# Altium schematic sheet Main&Motor&Connector.SchDoc
size A4
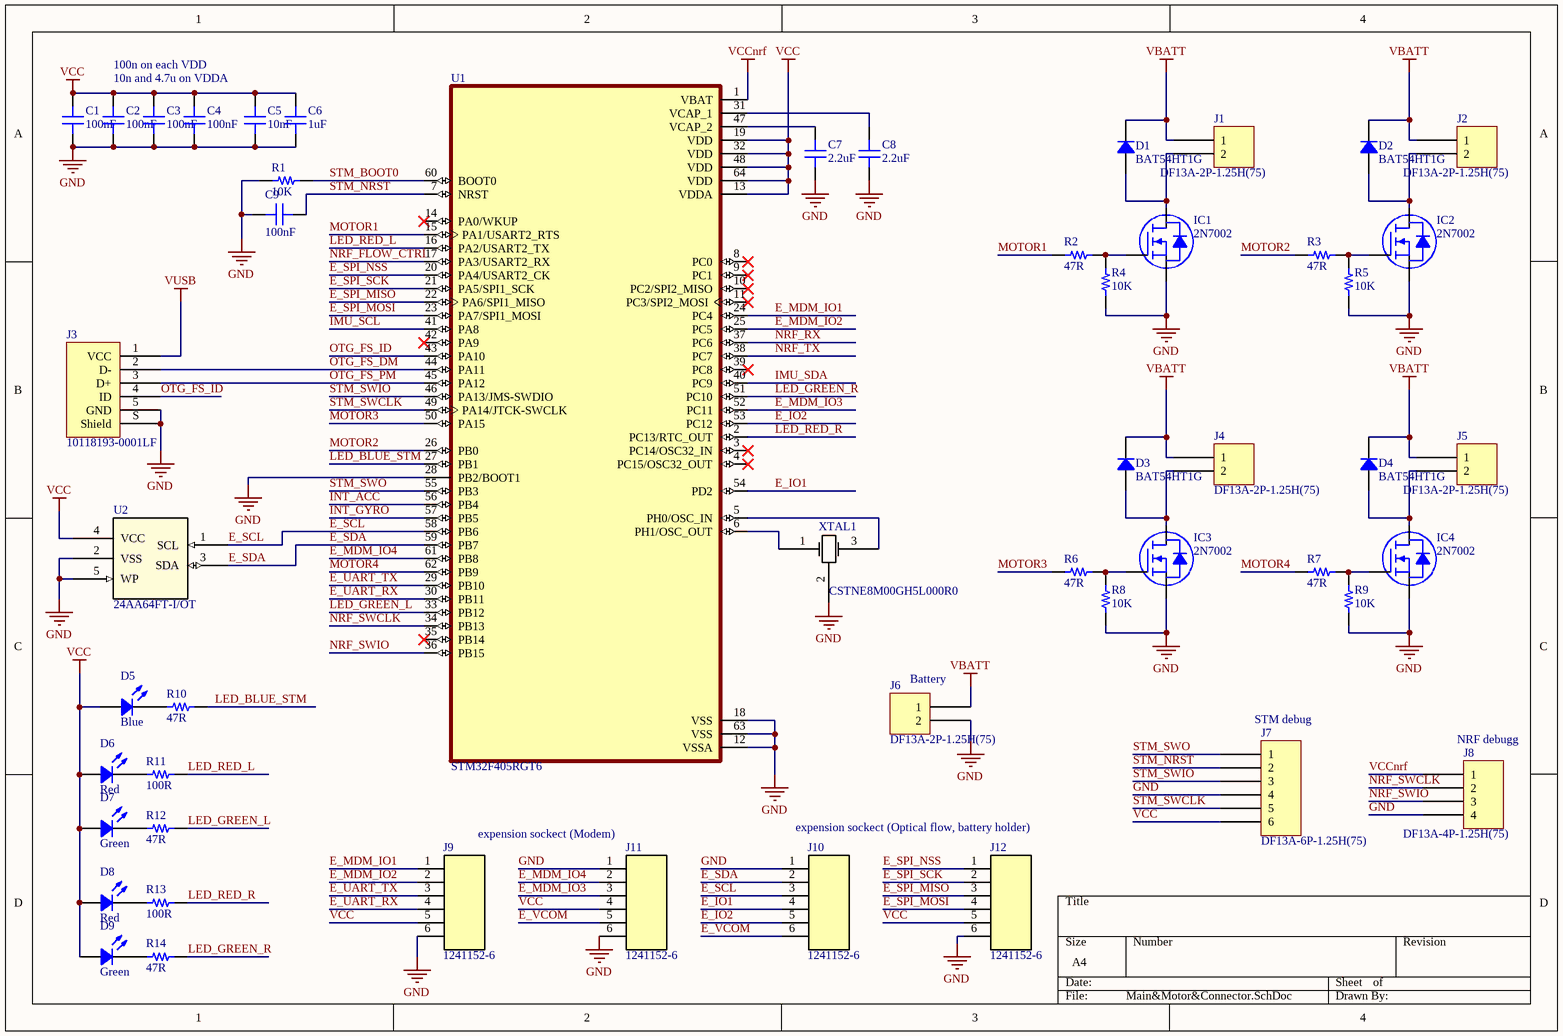
[diagram p0: Main&Motor&Connector.SchDoc]

## Parts
C1  100nF  [CAP 0402_1005]
C2  100nF  [CAP 0402_1005]
C3  100nF  [CAP 0402_1005]
C4  100nF  [CAP 0402_1005]
C5  10nF  [CAP 0402_1005]
C6  1uF  [CAP 0402_1005]
C7  2.2uF  [CAP 0603_1608]
C8  2.2uF  [CAP 0603_1608]
C9  100nF  [CAP 0402_1005]
D1  BAT54HT1G  [SOD323]
D2  BAT54HT1G  [SOD323]
D3  BAT54HT1G  [SOD323]
D4  BAT54HT1G  [SOD323]
D5  Blue  [LED 0603_1608 BLUE]
D6  Red  [LED 0603_1608 RED]
D7  Green  [LED 0603_1608 GREEN]
D8  Red  [LED 0603_1608 RED]
D9  Green  [LED 0603_1608 GREEN]
IC1  2N7002  [ON SEMI SOT-23-3]
IC2  2N7002  [ON SEMI SOT-23-3]
IC3  2N7002  [ON SEMI SOT-23-3]
IC4  2N7002  [ON SEMI SOT-23-3]
J1  DF13A-2P-1.25H(75)  [HIROSE DF13A-2P-1.25H]
J2  DF13A-2P-1.25H(75)  [HIROSE DF13A-2P-1.25H]
J3  10118193-0001LF  [FCI USB 10118193-0001LF]
J4  DF13A-2P-1.25H(75)  [HIROSE DF13A-2P-1.25H]
J5  DF13A-2P-1.25H(75)  [HIROSE DF13A-2P-1.25H]
J6  DF13A-2P-1.25H(75)  [HIROSE DF13A-2P-1.25H]
J7  DF13A-6P-1.25H(75)  [HIROSE DF13A-6P-1.25H]
J8  DF13A-4P-1.25H(75)  [HIROSE DF13A-4P-1.25H]
J9  1241152-6  [CONN_1241152-6_T]
J10  1241152-6  [CONN_1241152-6_T]
J11  1241152-6  [CONN_1241152-6_T]
J12  1241152-6  [CONN_1241152-6_T]
R1  10K  [RES 0402_1005]
R2  47R  [RES 0603_1608]
R3  47R  [RES 0603_1608]
R4  10K  [RES 0603_1608]
R5  10K  [RES 0603_1608]
R6  47R  [RES 0603_1608]
R7  47R  [RES 0603_1608]
R8  10K  [RES 0603_1608]
R9  10K  [RES 0603_1608]
R10  47R  [RES 0603_1608]
R11  100R  [RES 0603_1608]
R12  47R  [RES 0603_1608]
R13  100R  [RES 0603_1608]
R14  47R  [RES 0603_1608]
U1  STM32F405RGT6  [QFP50P1200X1200X160-64N]
U2  24AA64FT-I/OT  [SOT-23-5_MC_MCH]
XTAL1  CSTNE8M00GH5L000R0  [CSTNE8M00GH5L000]

## Nets
GND: C1.1 C2.1 C3.1 C4.1 C5.1 C6.1 C7.2 C8.1 C9.2 IC1.2(S) IC2.2(S) IC3.2(S) IC4.2(S) J3.5(GND) J3.S(Shield) J6.2 J7.4 J8.4 J9.6 J10.1 J11.1 J11.6 J12.6 R1.1 R4.1 R5.1 R8.1 R9.1 U1.12(VSSA) U1.18(VSS) U1.28(PB2/BOOT1) U1.63(VSS) U2.2(VSS) U2.5(WP) XTAL1.2(GND)
VBATT: D1.2 D2.2 D3.2 D4.2 J1.1 J2.1 J4.1 J5.1 J6.1
VCC: C1.2 C2.2 C3.2 C4.2 C5.2 C6.2 D5.1 D6.1 D7.1 D8.1 D9.1 J7.6 J9.5 J11.4 J12.5 U1.13(VDDA) U1.19(VDD) U1.32(VDD) U1.48(VDD) U1.64(VDD) U2.4(VCC)
VCCnrf: J8.1 U1.1(VBAT)
VUSB: J3.1(VCC)
E_IO1: J10.4 U1.54(PD2)
E_IO2: J10.5 U1.53(PC12)
E_MDM_IO1: J9.1 U1.24(PC4)
E_MDM_IO2: J9.2 U1.25(PC5)
E_MDM_IO3: J11.3 U1.52(PC11)
E_MDM_IO4: J11.2 U1.61(PB8)
E_SCL: J10.3 U1.58(PB6) U2.1(SCL)
E_SDA: J10.2 U1.59(PB7) U2.3(SDA)
E_SPI_MISO: J12.3 U1.22(PA6/SPI1_MISO)
E_SPI_MOSI: J12.4 U1.23(PA7/SPI1_MOSI)
E_SPI_NSS: J12.1 U1.20(PA4/USART2_CK)
E_SPI_SCK: J12.2 U1.21(PA5/SPI1_SCK)
E_UART_RX: J9.4 U1.30(PB11)
E_UART_TX: J9.3 U1.29(PB10)
E_VCOM: J10.6 J11.5
IMU_SCL: U1.41(PA8)
IMU_SDA: U1.40(PC9)
INT_ACC: U1.56(PB4)
INT_GYRO: U1.57(PB5)
LED_BLUE_STM: R10.1 U1.27(PB1)
LED_GREEN_L: R12.1 U1.33(PB12)
LED_GREEN_R: R14.1 U1.51(PC10)
LED_RED_L: R11.1 U1.16(PA2/USART2_TX)
LED_RED_R: R13.1 U1.2(PC13/RTC_OUT)
MOTOR1: R2.1 U1.15(PA1/USART2_RTS)
MOTOR2: R3.1 U1.26(PB0)
MOTOR3: R6.1 U1.50(PA15)
MOTOR4: R7.1 U1.62(PB9)
NRF_FLOW_CTRL: U1.17(PA3/USART2_RX)
NRF_RX: U1.37(PC6)
NRF_SWCLK: J8.2 U1.34(PB13)
NRF_SWIO: J8.3 U1.36(PB15)
NRF_TX: U1.38(PC7)
OTG_FS_DM: J3.2(D-) U1.44(PA11)
OTG_FS_ID: J3.4(ID) U1.43(PA10)
OTG_FS_PM: J3.3(D+) U1.45(PA12)
STM_BOOT0: R1.2 U1.60(BOOT0)
STM_NRST: C9.1 J7.2 U1.7(NRST)
STM_SWCLK: J7.5 U1.49(PA14/JTCK-SWCLK)
STM_SWIO: J7.3 U1.46(PA13/JMS-SWDIO)
STM_SWO: J7.1 U1.55(PB3)
NetC7_1: C7.1 U1.47(VCAP_2)
NetC8_2: C8.2 U1.31(VCAP_1)
NetD1_1: D1.1 IC1.3(D) J1.2
NetD2_1: D2.1 IC2.3(D) J2.2
NetD3_1: D3.1 IC3.3(D) J4.2
NetD4_1: D4.1 IC4.3(D) J5.2
NetD5_2: D5.2 R10.2
NetD6_2: D6.2 R11.2
NetD7_2: D7.2 R12.2
NetD8_2: D8.2 R13.2
NetD9_2: D9.2 R14.2
NetIC1_1: IC1.1(G) R2.2 R4.2
NetIC2_1: IC2.1(G) R3.2 R5.2
NetIC3_1: IC3.1(G) R6.2 R8.2
NetIC4_1: IC4.1(G) R7.2 R9.2
NetU1_5: U1.5(PH0/OSC_IN) XTAL1.3(OUTPUT)
NetU1_6: U1.6(PH1/OSC_OUT) XTAL1.1(INPUT)

Not connected (* = marked no-connect by the designer): U1 3(PC14/OSC32_IN)* 4(PC15/OSC32_OUT)* 8(PC0)* 9(PC1)* 10(PC2/SPI2_MISO)* 11(PC3/SPI2_MOSI)* 14(PA0/WKUP)* 35(PB14)* 39(PC8)* 42(PA9)*

## Notes on the sheet
- 100n on each VDD
- 10n and 4.7u on VDDA
- (near J6) Battery
- (near J7) STM debug
- (near J8) NRF debugg
- expension sockect (Modem)
- expension sockect (Optical flow, battery holder)

## Library data of the parts
C1-C6 C9 = C0402C104M4VACTU: CAP CER 0.1UF 16V Y5V 0402; Manufacturer: KEMET; Capacitance: 0.1µF; Temperature Coefficient: Y5V (F); Tolerance: ±20%; Part Number: C0402C104M4VACTU; Applications: General Purpose; ComponentLink1Description: Datasheet; ComponentLink1URL: //media.digikey.com/PDF/Data%20Sheets/Kemet%20PDFs/COG%20Dielectric.pdf; ComponentLink2Description: DigiKey Link; ComponentLink2URL: http://digikey.com/product-detail/en/kemet/C0402C104M4VACTU/399-7332-1-ND/3316949; Device Package: 0402 (1005 Metric); LastUpdated: 4/1/2020 11:57:05 PM; Lifecycle Status: Active; Minimum Order: 1; Mounting Type: Surface Mount, MLCC; Operating Temperature: -30°C ~ 85°C; Package / Case: 0402 (1005 Metric); Packaging: TapeAndReel; PartId: 1738; Part Status: Active; Price: 0.08; Series: SMD Comm Y5V; Size / Dimension: 0.039" L x 0.020" W (1.00mm x 0.50mm); Supplier 1: DigiKey; Supplier Part Number 1: 399-7332-1-ND; Thickness (Max): 0.022" (0.55mm); Voltage - Rated: 16V
  C1-C4 C9: Value: 100nF
  C5: Value: 10nF
  C6: Value: 1uF
C7 C8 = C0603X101F5GAC7867: CAP CER 100PF 50V C0G/NP0 0603; Manufacturer: KEMET; Temperature Coefficient: C0G, NP0; Tolerance: ±1%; Part Number: C0603X101F5GAC7867; Value: 2.2uF; Applications: Boardflex Sensitive; Capacitance: 100pF; ComponentLink1Description: Datasheet; ComponentLink1URL: https://api.kemet.com/component-edge/download/datasheet/C0603X101F5GAC7867.pdf; ComponentLink2Description: DigiKey Link; ComponentLink2URL: http://digikey.com/product-detail/en/kemet/C0603X101F5GAC7867/399-20433-1-ND/9925037; Device Package: 0603 (1608 Metric); Features: Low ESL, Soft Termination; LastUpdated: 1/21/2020 12:02:09 AM; Lifecycle Status: Active; Minimum Order: 1; Mounting Type: Surface Mount, MLCC; Operating Temperature: -55°C ~ 125°C; Package / Case: 0603 (1608 Metric); Packaging: TapeAndReel; PartId: 2140; Part Status: Active; Price: 0.46; Series: SMD Comm C0G Flex; Size / Dimension: 0.063" L x 0.031" W (1.60mm x 0.80mm); Supplier 1: DigiKey; Supplier Part Number 1: 399-20433-1-ND; Thickness (Max): 0.037" (0.95mm); Voltage - Rated: 50V
D1-D4 = BAT54HT1G: DIODE SCHOTTKY 30V 200MA SOD323; Manufacturer: ON Semiconductor; Capacitance @ Vr, F: 10pF @ 1V, 1MHz; Current - Average Rectified (Io): 200mA (DC); Current - Reverse Leakage @ Vr: 2µA @ 25V; Reverse Recovery Time (trr): 5ns; Speed: Small Signal =< 200mA (Io), Any Speed; Voltage - Forward (Vf) (Max) @ If: 800mV @ 100mA; Part Number: BAT54HT1G; ComponentLink1Description: Datasheet; ComponentLink1URL: //media.digikey.com/pdf/Data%20Sheets/Fairchild%20PDFs/BAT54HT1G_Rev_1.2.pdf; ComponentLink2Description: DigiKey Link; ComponentLink2URL: http://digikey.com/product-detail/en/on-semiconductor/BAT54HT1G/BAT54HT1GOSCT-ND/917809; Device Package: SC-76, SOD-323; Diode Type: Schottky; LastUpdated: 2/4/2020 3:13:59 PM; Lifecycle Status: Active; Minimum Order: 1; Mounting Type: Surface Mount; Operating Temperature - Junction: -55°C ~ 150°C; Package / Case: SC-76, SOD-323; Packaging: TapeAndReel; PartId: 3080; Part Status: Active; Price: 0.04; Series: -; Supplier 1: DigiKey; Supplier Part Number 1: BAT54HT1GOSCT-ND; Supplier Device Package: SOD-323; Voltage - DC Reverse (Vr) (Max): 30V
D5 = XZFBB53W-1: LED BLUE CLEAR 2SMD; Manufacturer: SunLED; Configuration: Standard; Current - Test: 20mA; Lens Color: Colorless; Lens Size: 1.20mm x 0.80mm; Lens Style: Rectangle with Flat Top; Millicandela Rating: 178mcd; Viewing Angle: 130°; Voltage - Forward (Vf) (Typ): 3.3V; Wavelength - Dominant: 470nm; Wavelength - Peak: 465nm; Part Number: XZFBB53W-1; Color: Blue; ComponentLink1Description: Datasheet; ComponentLink1URL: https://www.sunledusa.com/products/spec/XZFBB53W-1.pdf; ComponentLink2Description: DigiKey Link; ComponentLink2URL: http://digikey.com/product-detail/en/sunled/XZFBB53W-1/1497-1310-1-ND/6615742; Device Package: 0603 (1608 Metric); Height (Max): 0.85mm; LastUpdated: 1/21/2020 3:11:01 AM; Lens Transparency: Clear; Lifecycle Status: Active; Minimum Order: 1; Mounting Type: Surface Mount; Package / Case: 0603 (1608 Metric); Packaging: TapeAndReel; PartId: 782; Part Status: Active; Price: 0.15; Series: -; Size / Dimension: 1.60mm L x 0.80mm W; Supplier 1: DigiKey; Supplier Part Number 1: 1497-1310-1-ND; Supplier Device Package: 2-SMD; Value: Blue
D6 D8 = 5973005507F: LED RED 0603 SMD; Manufacturer: Dialight; Configuration: Standard; Current - Test: 20mA; Lens Color: 0.68mm; Lens Size: 1.20mm x 0.80mm; Lens Style: Rectangle with Flat Top; Millicandela Rating: 90mcd; Voltage - Forward (Vf) (Typ): 2V; Wavelength - Dominant: 630nm; Part Number: 5973005507F; Color: Red; ComponentLink1Description: Datasheet; ComponentLink1URL: http://www.dialightsignalsandcomponents.com/Assets/Drawings/2D_Drawings_DrawingDetailedSpec/NewDrawings/18369A.pdf; ComponentLink2Description: DigiKey Link; ComponentLink2URL: http://digikey.com/product-detail/en/dialight/5973005507F/350-4374-1-ND/9385480; Device Package: 0603 (1608 Metric); Height (Max): 0.68mm; LastUpdated: 1/21/2020 3:13:27 AM; Lifecycle Status: Active; Minimum Order: 1; Mounting Type: Surface Mount; Package / Case: 0603 (1608 Metric); Packaging: TapeAndReel; PartId: 378; Part Status: Active; Price: 0.11; Series: 597; Size / Dimension: 1.60mm L x 0.80mm W; Supplier 1: DigiKey; Supplier Part Number 1: 350-4374-1-ND; Supplier Device Package: 0603; Value: Red
D7 D9 = XZVG53W-3: LED GREEN CLEAR CHIP SMD; Manufacturer: SunLED; Configuration: Standard; Current - Test: 20mA; Lens Color: Colorless; Lens Size: 1.10mm x 0.80mm; Lens Style: Rectangle with Flat Top; Millicandela Rating: 49mcd; Viewing Angle: 120°; Voltage - Forward (Vf) (Typ): 2.1V; Wavelength - Dominant: 570nm; Wavelength - Peak: 574nm; Part Number: XZVG53W-3; Color: Green; ComponentLink1Description: Datasheet; ComponentLink1URL: https://www.sunledusa.com/products/spec/XZVG53W-3.pdf; ComponentLink2Description: DigiKey Link; ComponentLink2URL: http://digikey.com/product-detail/en/sunled/XZVG53W-3/1497-1214-1-ND/4745906; Device Package: 0603 (1608 Metric); Height (Max): 0.45mm; LastUpdated: 1/21/2020 3:12:15 AM; Lens Transparency: Clear; Lifecycle Status: Active; Minimum Order: 1; Mounting Type: Surface Mount; Package / Case: 0603 (1608 Metric); Packaging: TapeAndReel; PartId: 580; Part Status: Active; Price: 0.07; Series: -; Size / Dimension: 1.60mm L x 0.80mm W; Supplier 1: DigiKey; Supplier Part Number 1: 1497-1214-1-ND; Supplier Device Package: Chip LED; Value: Green
IC1-IC4 = 2N7002: MOSFET N-CH 60V 115MA SOT-23; Manufacturer: ON Semiconductor; Current - Continuous Drain (Id) @ 25°C: 115mA (Ta); Drive Voltage (Max Rds On,  Min Rds On): 5V, 10V; FET Type: N-Channel; Input Capacitance (Ciss) (Max) @ Vds: 50pF @ 25V; Power Dissipation (Max): 200mW (Ta); Rds On (Max) @ Id, Vgs: 7.5Ohm @ 500mA, 10V; Vgs (Max): ±20V; Vgs(th) (Max) @ Id: 2.5V @ 250µA; Part Number: 2N7002; ComponentLink1Description: Datasheet; ComponentLink1URL: https://www.onsemi.com/pub/Collateral/NDS7002A-D.PDF; ComponentLink2Description: DigiKey Link; ComponentLink2URL: http://digikey.com/product-detail/en/on-semiconductor/2N7002/2N7002NCT-ND/244664; Device Package: TO-236-3, SC-59, SOT-23-3; Drain to Source Voltage (Vdss): 60V; LastUpdated: 1/21/2020 4:01:12 AM; Lifecycle Status: Active; Minimum Order: 1; Mounting Type: Surface Mount; Operating Temperature: -55°C ~ 150°C (TJ); Package / Case: TO-236-3, SC-59, SOT-23-3; Packaging: TapeAndReel; Part Status: Active; Price: 0.06; Series: -; Supplier 1: DigiKey; Supplier Part Number 1: 2N7002NCT-ND; Supplier Device Package: SOT-23 (TO-236AB); Technology: MOSFET (Metal Oxide)
J1 J2 J4-J6 = DF13A-2P-1.25H(75): CONN HEADER SMD R/A 2POS 1.25MM; Manufacturer: Hirose Electric Co Ltd; Current Rating (Amps): 1A; Material Flammability Rating: UL94 V-0; Number of Positions: 2; Number of Positions Loaded: All; Pitch - Mating: 0.049" (1.25mm); Shrouding: Shrouded - 4 Wall; Style: Board to Cable/Wire; Voltage Rating: 150V; Part Number: DF13A-2P-1.25H(75); ComponentLink1Description: Datasheet; ComponentLink1URL: https://www.hirose.com/product/download/?distributor=digikey&type=specSheet&lang=en&num=DF13A-2P-1.25H(75); ComponentLink2Description: DigiKey Link; ComponentLink2URL: //digikey.com/product-detail/en/hirose-electric-co-ltd/DF13A-2P-1.25H-75/H126434-ND/9170674; Connector Type: Header; Contact Finish - Mating: Tin; Contact Finish - Post: Tin; Contact Finish Thickness - Mating: 39.4µin (1.00µm); Contact Material: Brass; Contact Shape: Square; Contact Type: Male Pin; Fastening Type: Detent Lock; Features: Solder Retention; Insulation Color: Beige; Insulation Height: 0.142" (3.60mm); Insulation Material: Polyamide (PA), Nylon; LastUpdated: 12/16/2019 7:33:40 PM; Lifecycle Status: 0; Minimum Order: 1; Mounting Type: Surface Mount, Right Angle; Number of Rows: 1; Operating Temperature: -35°C ~ 85°C; Packaging: Tube; PartId: 6; Part Status: Active; Price: 0.37; Series: DF13; Supplier 1: DigiKey; Supplier Part Number 1: H126434-ND; Termination: Solder
J3 = 10118193-0001LF: CONN RCPT USB2.0 MICRO B SMD R/A; Manufacturer: Amphenol ICC (FCI); Connector Type: USB - micro B; Current Rating (Amps): 1.8A per Contact; Gender: Receptacle; Mating Cycles: 10000; Number of Contacts: 5; Number of Ports: 1; Shielding: Shielded; Voltage - Rated: 100VAC; Part Number: 10118193-0001LF; ComponentLink1Description: Datasheet; ComponentLink1URL: https://cdn.amphenol-icc.com/media/wysiwyg/files/documentation/datasheet/inputoutput/io_usb_micro.pdf; ComponentLink2Description: DigiKey Link; ComponentLink2URL: //digikey.com/product-detail/en/amphenol-icc-fci/10118193-0001LF/609-4616-2-ND/2785388; Features: Solder Retention; LastUpdated: 12/9/2019 8:51:28 PM; Lifecycle Status: 0; Minimum Order: 1; Mounting Feature: Horizontal; Mounting Type: Surface Mount, Right Angle; Through Hole; Operating Temperature: -30°C ~ 80°C; Packaging: TapeAndReel; Part Status: Active; Price: 0.21; Series: -; Specifications: USB 2.0; Supplier 1: DigiKey; Supplier Part Number 1: 609-4616-2-ND; Termination: Solder
J7 = DF13A-6P-1.25H(75): CONN HEADER SMD R/A 6POS 1.25MM; Manufacturer: Hirose Electric Co Ltd; Current Rating (Amps): 1A; Material Flammability Rating: UL94 V-0; Number of Positions: 6; Number of Positions Loaded: All; Pitch - Mating: 0.049" (1.25mm); Shrouding: Shrouded - 4 Wall; Style: Board to Cable/Wire; Voltage Rating: 150V; Part Number: DF13A-6P-1.25H(75); ComponentLink1Description: Datasheet; ComponentLink1URL: https://www.hirose.com/product/document?clcode=CL0536-0109-0-76&productname=DF13-10P-1.25DSA(76)&series=DF13&documenttype=Catalog&lang=en&documentid=D31687_en; ComponentLink2Description: DigiKey Link; ComponentLink2URL: http://digikey.com/product-detail/en/hirose-electric-co-ltd/DF13A-6P-1.25H-75/H126442-ND/9170682; Connector Type: Header; Contact Finish - Mating: Tin; Contact Finish - Post: Tin; Contact Finish Thickness - Mating: 39.4µin (1.00µm); Contact Material: Brass; Contact Shape: Square; Contact Type: Male Pin; Fastening Type: Detent Lock; Features: Solder Retention; Insulation Color: Beige; Insulation Height: 0.142" (3.60mm); Insulation Material: Polyamide (PA), Nylon; LastUpdated: 1/15/2020 3:36:45 AM; Lifecycle Status: Active; Minimum Order: 1; Mounting Type: Surface Mount, Right Angle; Number of Rows: 1; Operating Temperature: -35°C ~ 85°C; Packaging: Tube; PartId: 10; Part Status: Active; Price: 0.51; Series: DF13; Supplier 1: DigiKey; Supplier Part Number 1: H126442-ND; Termination: Solder
J8 = DF13A-4P-1.25H(75): CONN HEADER SMD R/A 4POS 1.25MM; Manufacturer: Hirose Electric Co Ltd; Current Rating (Amps): 1A; Material Flammability Rating: UL94 V-0; Number of Positions: 4; Number of Positions Loaded: All; Pitch - Mating: 0.049" (1.25mm); Shrouding: Shrouded - 4 Wall; Style: Board to Cable/Wire; Voltage Rating: 150V; Part Number: DF13A-4P-1.25H(75); ComponentLink1Description: Datasheet; ComponentLink1URL: https://www.hirose.com/product/download/?distributor=digikey&type=specSheet&lang=en&num=DF13A-4P-1.25H(75); ComponentLink2Description: DigiKey Link; ComponentLink2URL: //digikey.com/product-detail/en/hirose-electric-co-ltd/DF13A-4P-1.25H-75/H126438-ND/9170678; Connector Type: Header; Contact Finish - Mating: Tin; Contact Finish - Post: Tin; Contact Finish Thickness - Mating: 39.4µin (1.00µm); Contact Material: Brass; Contact Shape: Square; Contact Type: Male Pin; Fastening Type: Detent Lock; Features: Solder Retention; Insulation Color: Beige; Insulation Height: 0.142" (3.60mm); Insulation Material: Polyamide (PA), Nylon; LastUpdated: 12/16/2019 7:34:28 PM; Lifecycle Status: 0; Minimum Order: 1; Mounting Type: Surface Mount, Right Angle; Number of Rows: 1; Operating Temperature: -35°C ~ 85°C; Packaging: Tube; PartId: 8; Part Status: Active; Price: 0.45; Series: DF13; Supplier 1: DigiKey; Supplier Part Number 1: H126438-ND; Termination: Solder
J9-J12 = 1241152-6: con 6pos 2.54mm TE connectivity; Built_By: EMA_UL_Team; SourceLibrary: Tyco_2012-1-03; Vendor: TE Connectivity; Manufacturer_Part_Number: 1241152-6; Copyright: Copyright (C) 2016 Accelerated Designs. All rights reserved; RefDes: RefDes; Type: DEV
R1 = RT0402FRE074K7L: RES SMD 4.7K OHM 1% 1/16W 0402; Manufacturer: Yageo; Power (Watts): 0.063W, 1/16W; Resistance: 4.7 kOhms; Temperature Coefficient: ±50ppm/°C; Part Number: RT0402FRE074K7L; Value: 10K; ComponentLink1Description: Datasheet; ComponentLink1URL: https://www.yageo.com/upload/media/product/productsearch/datasheet/rchip/PYu-RT_1-to-0.01_RoHS_L_11.pdf; ComponentLink2Description: DigiKey Link; ComponentLink2URL: http://digikey.com/product-detail/en/yageo/RT0402FRE074K7L/YAG3347CT-ND/5418052; Composition: Thin Film; Device Package: 0402 (1005 Metric); Height - Seated (Max): 0.014" (0.35mm); LastUpdated: 1/21/2020 12:06:02 AM; Lifecycle Status: Active; Minimum Order: 1; Number of Terminations: 2; Operating Temperature: -55°C ~ 155°C; Package / Case: 0402 (1005 Metric); Packaging: TapeAndReel; PartId: 3198; Part Status: Active; Price: 0.01; Series: RT; Size / Dimension: 0.039" L x 0.020" W (1.00mm x 0.50mm); Supplier 1: DigiKey; Supplier Part Number 1: YAG3347CT-ND; Supplier Device Package: 0402; Tolerance: ±1%
R2-R14 = AC0603FR-0710KL: RES SMD 10K OHM 1% 1/10W 0603; Manufacturer: Yageo; Power (Watts): 0.1W, 1/10W; Resistance: 10 kOhms; Temperature Coefficient: ±100ppm/°C; Part Number: AC0603FR-0710KL; ComponentLink1Description: Datasheet; ComponentLink1URL: https://www.yageo.com/upload/media/product/productsearch/datasheet/rchip/PYu-AC_51_RoHS_L_7.pdf; ComponentLink2Description: DigiKey Link; ComponentLink2URL: http://digikey.com/product-detail/en/yageo/AC0603FR-0710KL/311-10KLDCT-ND/2828135; Composition: Thick Film; Device Package: 0603 (1608 Metric); Features: Automotive AEC-Q200, Moisture Resistant; Height - Seated (Max): 0.022" (0.55mm); LastUpdated: 1/21/2020 12:19:55 AM; Lifecycle Status: Active; Minimum Order: 1; Number of Terminations: 2; Operating Temperature: -55°C ~ 155°C; Package / Case: 0603 (1608 Metric); Packaging: CutTape; PartId: 17347; Part Status: Active; Price: 0.10; Ratings: AEC-Q200; Series: AC; Size / Dimension: 0.063" L x 0.031" W (1.60mm x 0.80mm); Supplier 1: DigiKey; Supplier Part Number 1: 311-10KLDCT-ND; Supplier Device Package: 0603; Tolerance: ±1%
  R2 R3 R6 R7 R10 R12 R14: Value: 47R
  R4 R5 R8 R9: Value: 10K
  R11 R13: Value: 100R
U1 = STM32F405RGT6: ARMÂ® CortexÂ®-M4 STM32F4 Microcontroller IC 32-Bit 168MHz 1MB _1M x 8_ FLASH 64-LQFP _10x10_; MF: STMicroelectronics; Package: LQFP-64 STMicroelectronics; Digi-Key_Purchase_URL: https://www.digikey.com/product-detail/en/stmicroelectronics/STM32F405RGT6/497-11767-ND/2754208?utm_source=snapeda&utm_medium=aggregator&utm_campaign=symbol; Value: *; MP: STM32F405RGT6; SnapEDA_Link: https://www.snapeda.com/parts/STM32F405RGT6/STMicroelectronics/view-part/105502/?ref=snap; Digi-Key_Part_Number: 497-11767-ND
U2 = 24AA64FT-I/OT: No Description Available; Vendor: Microchip; Built_By: EMA_Jessica; SourceLibrary: Microchip_2019-08-23_20; Manufacturer_Part_Number: 24AA64FT-I/OT; Copyright: Copyright (C) 2018 Accelerated Designs. All rights reserved; RefDes: RefDes; Type: DEV
XTAL1 = CSTNE8M00GH5L000: No Description Available; Vendor: Murata; Built_By: EMA_Cory; SourceLibrary: Murata_2020-02-28; Datasheet: https://www.murata.com/en/products/productdata/8801161805854/SPEC-CSTNE8M00GH5L000R0.pdf; Manufacturer_Part_Number: CSTNE8M00GH5L000R0; Copyright: Copyright (C) 2018 Accelerated Designs. All rights reserved; RefDes: RefDes; Type: DEV